# Altium schematic sheet Module ESP32.SchDoc: MesureTH
size 276 x 198 mm; Date: 21.08.2024; CheckedBy: CFO; DrawnBy: MPT; Organization: ETML-ES; Address1: Av. Recordon 1bis; Address2: 1004 Lausanne; Address3: Suisse; DocumentNumber: 2409; Revision: 2409; SheetNumber: 4; SheetTotal: 5; CheckingDate: 26.08.2024
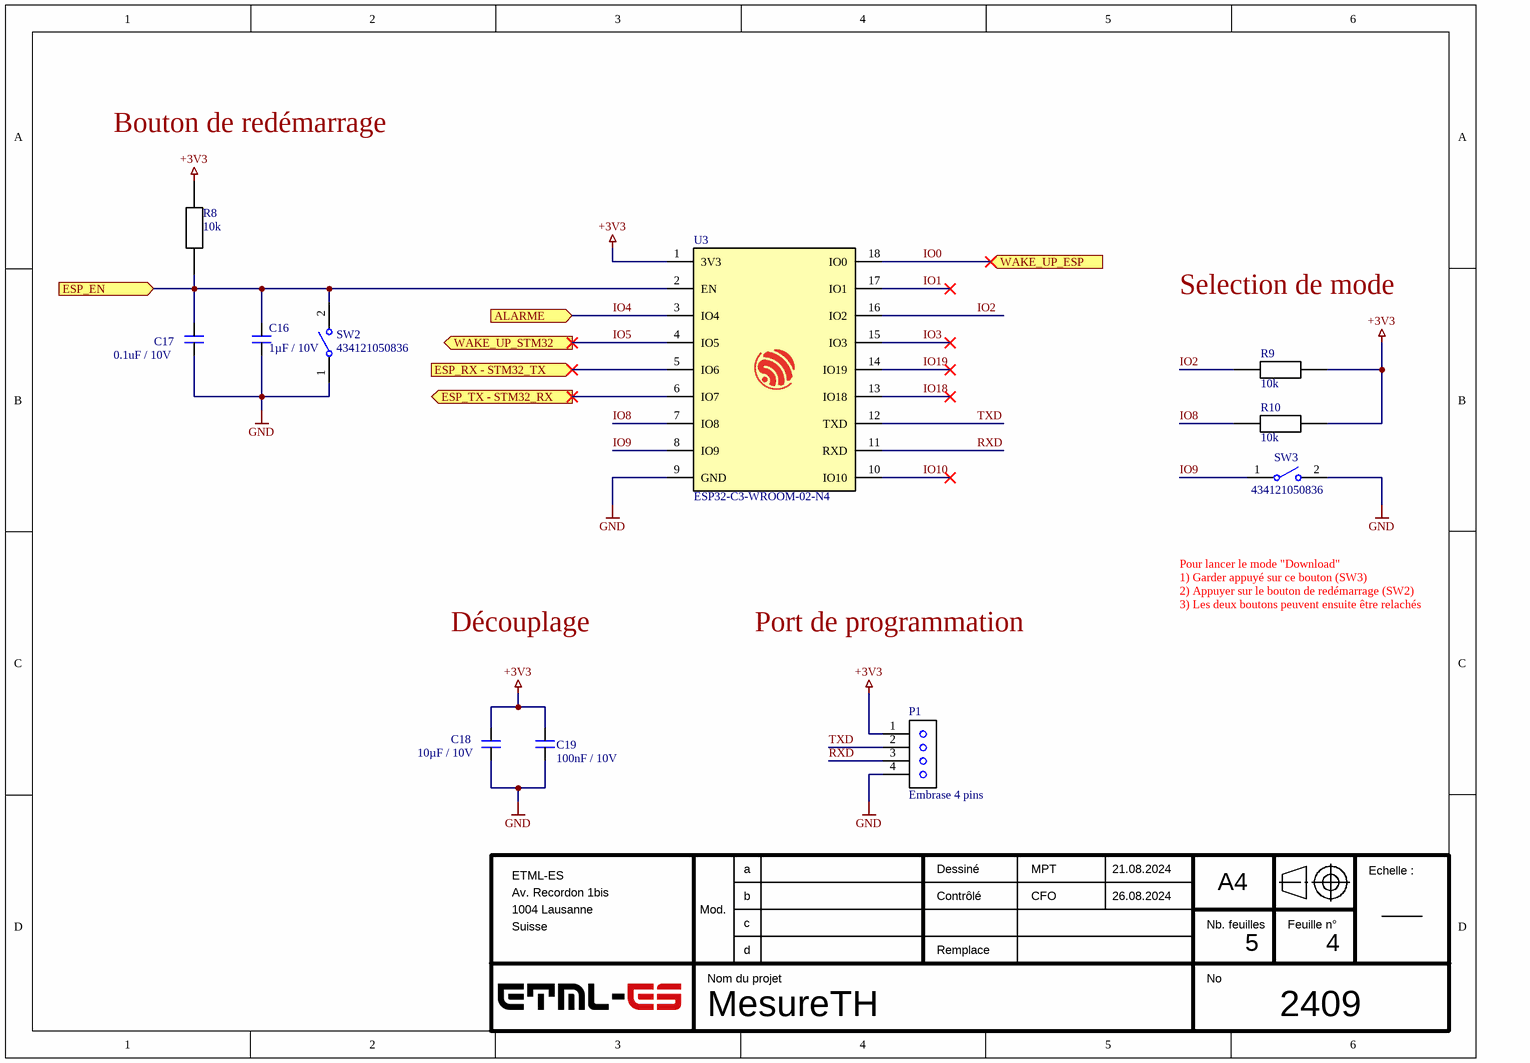
[diagram p0: Module ESP32.SchDoc]

## Parts
C16  1µF / 10V  [WCAP-CSGP_0805_L2W1.25H0.8_Wave]
C17  0.1uF / 10V  [WCAP-CSGP_0805_L2W1.25H0.8_Wave]
C18  10µF / 10V  [WCAP-CSGP_0805_L2W1.25H0.8_Wave]
C19  100nF / 10V  [WCAP-CSGP_0805_L2W1.25H0.8_Wave]
P1  Embrase 4 pins  [1x4]
R8  10k  [WRIS-PSMB_0805_L2W1.25H0.35]
R9  10k  [WRIS-PSMB_0805_L2W1.25H0.35]
R10  10k  [WRIS-PSMB_0805_L2W1.25H0.35]
SW2  434121050836  [WS-TASV_L6W3.5H5_4341x10508x6]
SW3  434121050836  [WS-TASV_L6W3.5H5_4341x10508x6]
U3  ESP32-C3-WROOM-02-N4  [ESP32-C3-WROOM-02-H4]

## Ports
ALARME (in), ESP_EN (in), ESP_RX - STM32_TX (in), ESP_TX - STM32_RX (out), WAKE_UP_ESP (in), WAKE_UP_STM32 (out)

## Nets
+3V3: C18.1(+) C19.1(+) P1.1(VCC) R8.2 R9.2 R10.2 U3.1(3V3)
GND: C16.2(-) C17.2(-) C18.2(-) C19.2(-) P1.4(VCC) SW2.1 SW3.2 U3.9(GND)
ESP_EN: C16.1(+) C17.1(+) R8.1 SW2.2 U3.2(EN) ; port ESP_EN
ESP_RX - STM32_TX: U3.5(IO6) ; port ESP_RX - STM32_TX
ESP_TX - STM32_RX: U3.6(IO7) ; port ESP_TX - STM32_RX
IO0: U3.18(IO0) ; port WAKE_UP_ESP
IO1: U3.17(IO1)
IO2: R9.1 U3.16(IO2)
IO3: U3.15(IO3)
IO4: U3.3(IO4) ; port ALARME
IO5: U3.4(IO5) ; port WAKE_UP_STM32
IO8: R10.1 U3.7(IO8)
IO9: SW3.1 U3.8(IO9)
IO10: U3.10(IO10)
IO18: U3.13(IO18)
IO19: U3.14(IO19)
RXD: P1.3(VCC) U3.11(RXD)
TXD: P1.2(VCC) U3.12(TXD)

## Notes on the sheet
- Bouton de redémarrage
- Selection de mode
- Pour lancer le mode "Download"
- 1) Garder appuyé sur ce bouton (SW3)
- 2) Appuyer sur le bouton de redémarrage (SW2)
- 3) Les deux boutons peuvent ensuite être relachés
- Découplage
- Port de programmation
- a
- Dessiné
- A4
- Echelle :
- Mod.
- b
- c
- d
- Contrôlé
- Remplace
- Nb. feuilles
- Feuille n°
- Nom du projet
- No

## Library data of the parts
C16-C19 = CAPA: Tension: *
R8-R10 = Resistance
SW2 SW3 = CMP-1459-00008-2: NexarPartId: 57114500; Throw Configuration: SPST; Switch Travel: 250µm; Switch Function: Off-Mom; Current Rating: 50mA; Illumination Type: Non-Illuminated; Mechanical Life: 50kcycles; Voltage Rating: 12V; Insulation Resistance: 100MΩ; Actuator Material: Liquid Crystal Polymer, Polymer; Packaging: Tape and Reel; Min Operating Temperature: -40°C; Height: 5mm; Termination: SMD/SMT; Max Operating Temperature: 85°C; RoHS: Compliant; Contact Plating: Silver
U3 = ESP32-C3-WROOM-02-N4: WiFi Modules (802.11) (Engineering Samples) SMD module, ESP32-C3, 4MB SPI flash, PCB antenna, -40 C +85 C; Manufacturer_Name: Espressif Systems; Geometry.Height: 3.35mm; Manufacturer_Part_Number: ESP32-C3-WROOM-02-N4; Mouser Part Number: 356-ESP32C3WROOM02N4; Mouser Price/Stock: https://www.mouser.co.uk/ProductDetail/Espressif-Systems/ESP32-C3-WROOM-02-N4?qs=stqOd1AaK7%2FqjTZKEOgfUg%3D%3D; Arrow Part Number: *; Arrow Price/Stock: *; Datasheet Link: https://www.mouser.ch/datasheet/2/891/Espressif_ESP32_C3_WROOM_02-2006871.pdf